# Altium schematic sheet RS232.SchDoc
size A4; SheetNumber: 3; SheetTotal: 6
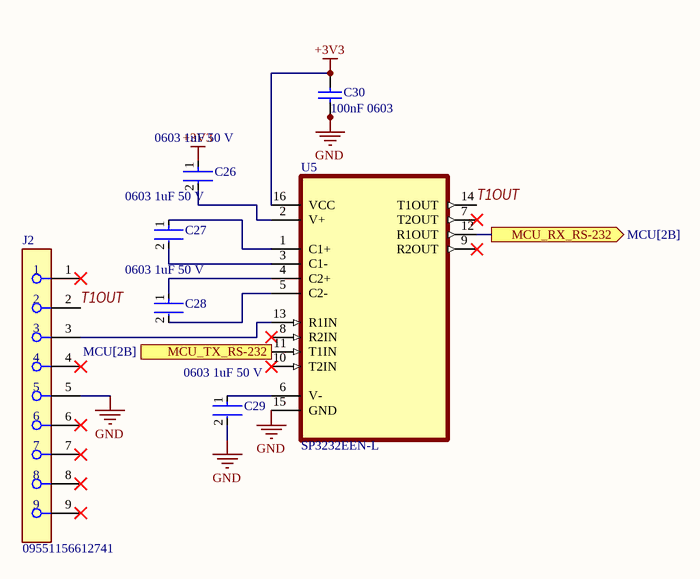
[diagram p0: RS232.SchDoc]

## Parts
C26  0603 1uF 50 V  [FP-CC0603-DB-MFG]
C27  0603 1uF 50 V  [FP-CC0603-DB-MFG]
C28  0603 1uF 50 V  [FP-CC0603-DB-MFG]
C29  0603 1uF 50 V  [FP-CC0603-DB-MFG]
C30  100nF 0603  [CAPC1608X90X35LL15T15]
J2  09551156612741  [FP-09551156612741-MFG]
U5  SP3232EEN-L  [SOIC127P600X175-16N]

## Ports
MCU_RX_RS-232 (out, see MCU[2B]), MCU_TX_RS-232 (in, see MCU[2B])

## Nets
+3V3: C26.1 C30.2 U5.16(VCC)
GND: C29.2 C30.1 J2.5 U5.15(GND)
MCU_RX_RS-232: U5.12(R1OUT) ; port MCU_RX_RS-232
MCU_TX_RS-232: U5.11(T1IN) ; port MCU_TX_RS-232
T1OUT: J2.2 U5.14(T1OUT)
NetC26_2: C26.2 U5.2(V+)
NetC27_1: C27.1 U5.1(C1+)
NetC27_2: C27.2 U5.3(C1-)
NetC28_1: C28.1 U5.4(C2+)
NetC28_2: C28.2 U5.5(C2-)
NetC29_1: C29.1 U5.6(V-)
NetJ2_3: J2.3 U5.13(R1IN)

Not connected (* = marked no-connect by the designer): J2 1* 4* 6* 7* 8* 9*; U5 7(T2OUT)* 8(R2IN)* 9(R2OUT)* 10(T2IN)*

## Library data of the parts
C26-C29 = CMP-03422-000761-2: CAP CER 1UF 50V X7R 0603; Tolerance: 10%; Lead Free: Lead Free; Max Operating Temperature: 125°C; Width: 0.031inch; Voltage Rating: 50V; Mount: Surface Mount; Resistor Type: Ceramic; Halogen Free: Halogen Free; Weight: 7.1E-05oz; Voltage Rating (DC): 50V; Package Quantity: 4000; Termination: SMD/SMT; Length: 0.063inch; Min Operating Temperature: -55°C; Dielectric: X7R; Case Code (Metric): 1608; Case Code (Imperial): 0603; Packaging: Tape and Reel; Thickness: 0.035inch; Capacitance: 1uF; Case/Package: 0603
C30 = CMP-2006-04391-1: Manufacturer: AVX Interconnect / Elco; Part Number: 06035C104KAZ2A
J2 = CMP-33115-000006-1: CONN D-SUB RCPT 9POS SMD SLDR; Number of Positions: 9; Gender: Receptacle; Body Material: Steel; Pitch: 2.74mm; Current Rating: 5A; Mating Cycles: 250; Number of Contacts: 9; Color: Black; Contact Plating: Gold; Mount: Surface Mount; Housing Material: Polymer; Termination: Solder; Depth: 12.25mm; Max Operating Temperature: 125°C; Length: 31.12mm; Number of Rows: 2; RoHS Compliant: Yes; Min Operating Temperature: -55°C; Contact Material: Bronze; Width: 12.5mm; Packaging: Tape and Reel; Orientation: Straight; REACH SVHC: No SVHC; Connector Type: D-Sub
U5 = SP3232EEN-L: 2/2 Transceiver Full RS232 16-SOIC; MF: MaxLinear, Inc.; SnapEDA_Link: https://www.snapeda.com/parts/SP3232EEN-L/MaxLinear/view-part/?ref=snap; Package: SOIC-16 Exar; Value: *; MP: SP3232EEN-L; Check_prices: https://www.snapeda.com/parts/SP3232EEN-L/MaxLinear/view-part/?ref=eda